# Altium schematic sheet SOCUSBHSPHY.SchDoc
size A4; SheetNumber: 18; SheetTotal: 18
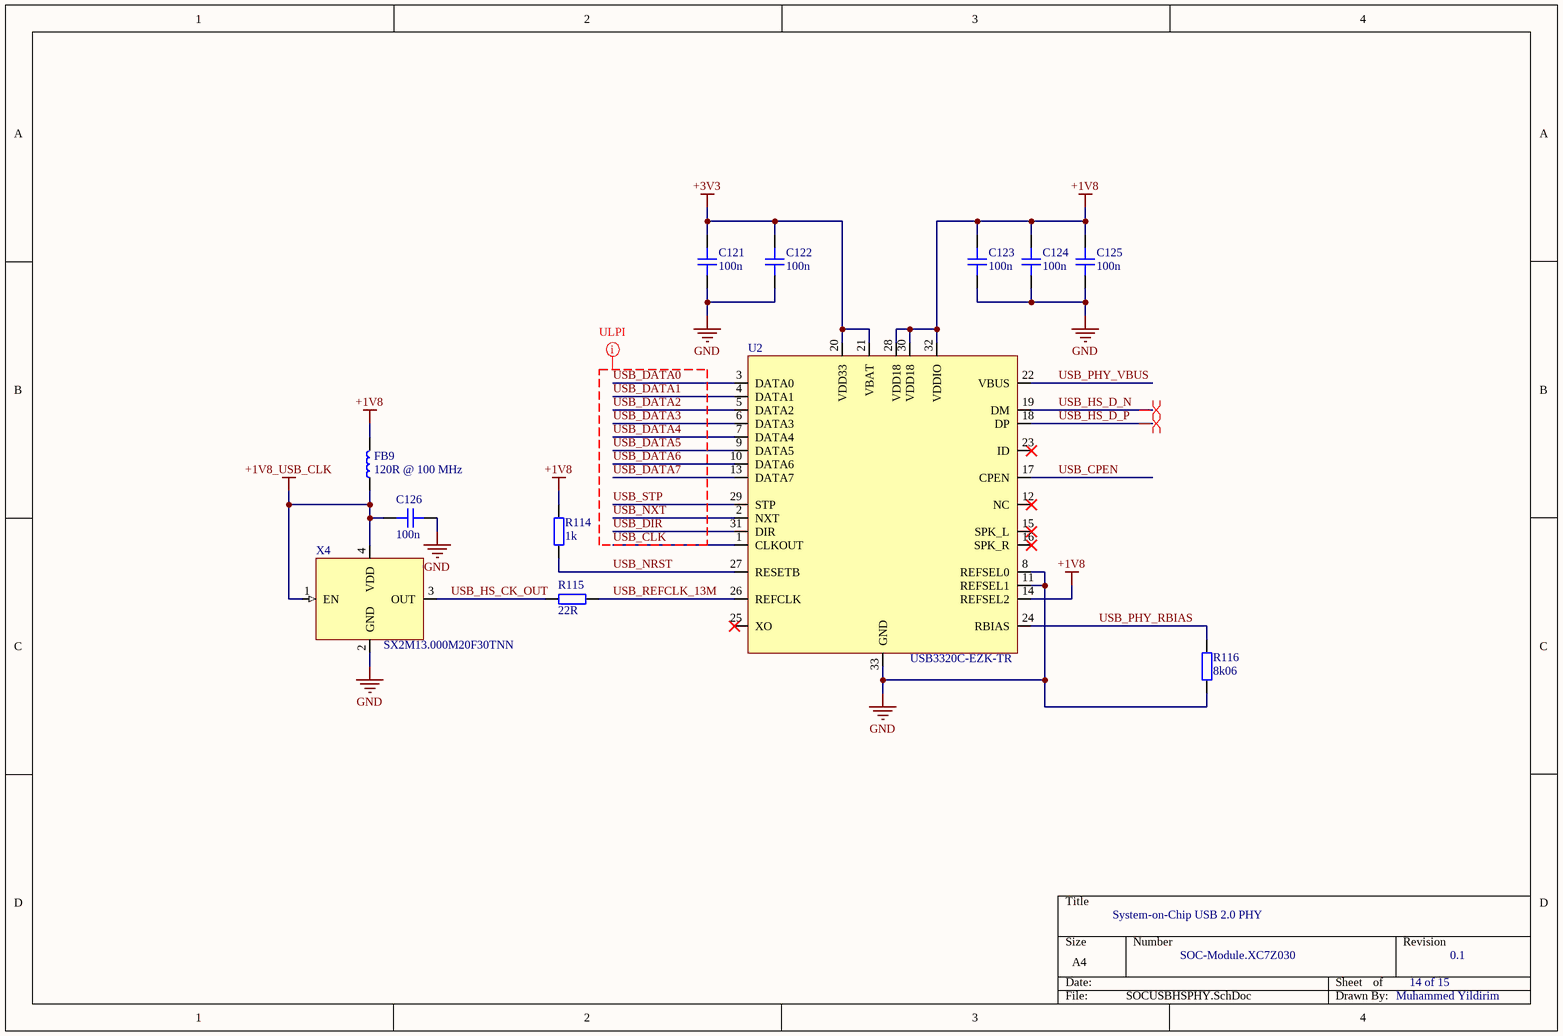
[diagram p0: SOCUSBHSPHY.SchDoc]

## Parts
C121  100n  [CAP_0201]
C122  100n  [CAP_0201]
C123  100n  [CAP_0201]
C124  100n  [CAP_0201]
C125  100n  [CAP_0201]
C126  100n  [CAP_0201]
FB9  120R @ 100 MHz  [IND_0201]
R114  1k  [RES_0201]
R115  22R  [RES_0201]
R116  8k06  [RES_0201]
U2  USB3320C-EZK-TR  [QFN-32-5x5x0.85mm]
X4  SX2M13.000M20F30TNN  [XTAL_2520]

## Nets
+1V8: C123.2 C124.2 C125.2 FB9.2 R114.1 U2.14(REFSEL2) U2.28(VDD18) U2.30(VDD18) U2.32(VDDIO)
+1V8_USB_CLK: C126.2 FB9.1 X4.1(EN) X4.4(VDD)
+3V3: C121.2 C122.2 U2.20(VDD33) U2.21(VBAT)
GND: C121.1 C122.1 C123.1 C124.1 C125.1 C126.1 R116.1 U2.8(REFSEL0) U2.11(REFSEL1) U2.33(GND) X4.2(GND)
USB_CLK: U2.1(CLKOUT)
USB_CPEN: U2.17(CPEN)
USB_DATA0: U2.3(DATA0)
USB_DATA1: U2.4(DATA1)
USB_DATA2: U2.5(DATA2)
USB_DATA3: U2.6(DATA3)
USB_DATA4: U2.7(DATA4)
USB_DATA5: U2.9(DATA5)
USB_DATA6: U2.10(DATA6)
USB_DATA7: U2.13(DATA7)
USB_DIR: U2.31(DIR)
USB_HS_CK_OUT: R115.1 X4.3(OUT)
USB_HS_D_N: U2.19(DM)
USB_HS_D_P: U2.18(DP)
USB_NRST: R114.2 U2.27(RESETB)
USB_NXT: U2.2(NXT)
USB_PHY_RBIAS: R116.2 U2.24(RBIAS)
USB_PHY_VBUS: U2.22(VBUS)
USB_REFCLK_13M: R115.2 U2.26(REFCLK)
USB_STP: U2.29(STP)

Not connected (* = marked no-connect by the designer): U2 12(NC)* 15(SPK_L)* 16(SPK_R)* 23(ID)* 25(XO)*

## Layout directives
mark named ULPI: USB_CLK, USB_DATA0, USB_DATA1, USB_DATA2, USB_DATA3, USB_DATA4, USB_DATA5, USB_DATA6, USB_DATA7, USB_DIR, USB_NXT, USB_STP
differential pair: USB_HS_D_N, USB_HS_D_P

## Notes on the sheet
- System-on-Chip USB 2.0 PHY
- SOC-Module.XC7Z030
- 14 of 15
- 0.1
- Muhammed Yildirim

## Library data of the parts
C121-C126 = CAP_0201: Capacitor SMD 0201; Manufacturer: *; Manufacturer Part Number: *; Distributor Link: *; LCSC: *; Rating: *; Dielectric: *
FB9 = IND_0201: Inductor SMD 0201; Manufacturer_Name: Murata Electronics; Manufacturer_Part_Number: LQP03HQ56NH02D; Datasheet Link: https://psearch.en.murata.com/inductor/product/LQP03HQ56NH02%23.html; Height: 0.42mm; Mouser Part Number: 81-LQP03HQ56NH02D; Mouser Price/Stock: https://www.mouser.co.uk/ProductDetail/Murata-Electronics/LQP03HQ56NH02D?qs=B6kkDfuK7%2FBQu1Ob9%2FT2Bg%3D%3D
R114-R116 = RES_0201: Resistor SMD 0201; Manufacturer: *; Manufacturer Part Number: *; Distributor Link: *; LCSC: *
U2 = USB3320C-EZK-TR: Hi-Speed USB 2.0 ULPI Transceiver; Manufacturer: Microchip; Manufacturer Part Number: USB3320C-EZK-TR
X4 = ECS-2520MV-130-BN-TR: Standard Clock Oscillators XO (Standard),13MHz,Standby (Power Down),CMOS, Multi-Volt,1.6 V 3.6 V,+/-50ppm,-40 C 85 C,6mA,Surface Mount,4-SMD, No Lead,(2.50mm x 2.00mm),(0.80mm); Manufacturer: ECS; Manufacturer Part Number: ECS-2520MV-130-BN-TR